# Altium schematic sheet Power Flow.SchDoc
size A3; Date: 2026/04/16; ApprovedBy: NA; Author: 邱上峯; CompanyName: JFM常裕富士機工; Engineer: 邱上峯; Revision: V1.0; SheetNumber: 2; SheetTotal: 9; Pcb Name: NA
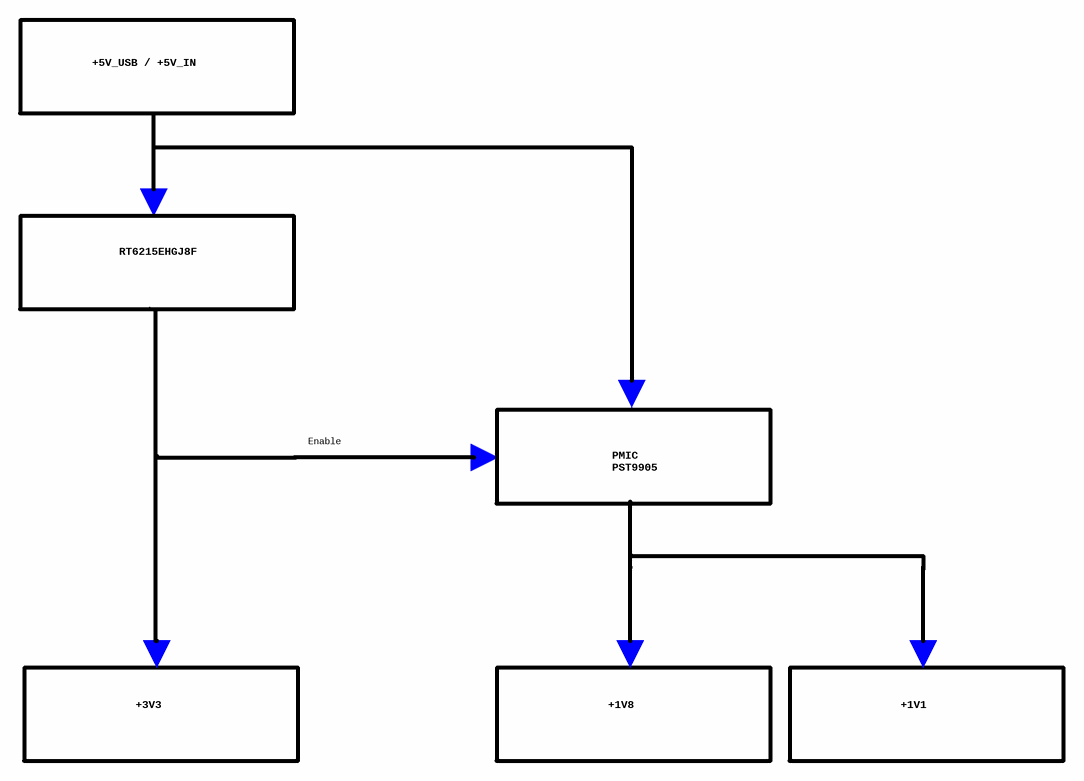
[diagram p0: Power Flow.SchDoc]

## Notes on the sheet
- +5V_USB / +5V_IN
- RT6215EHGJ8F
- Enable
- PMIC
  PST9905
- +3V3
- +1V8
- +1V1
- Title:
- Project:
- Date:
- Author:
- Revision:
- Engineer:
- Pcb Name:
- Sheet
- ApprovedBy:
- of